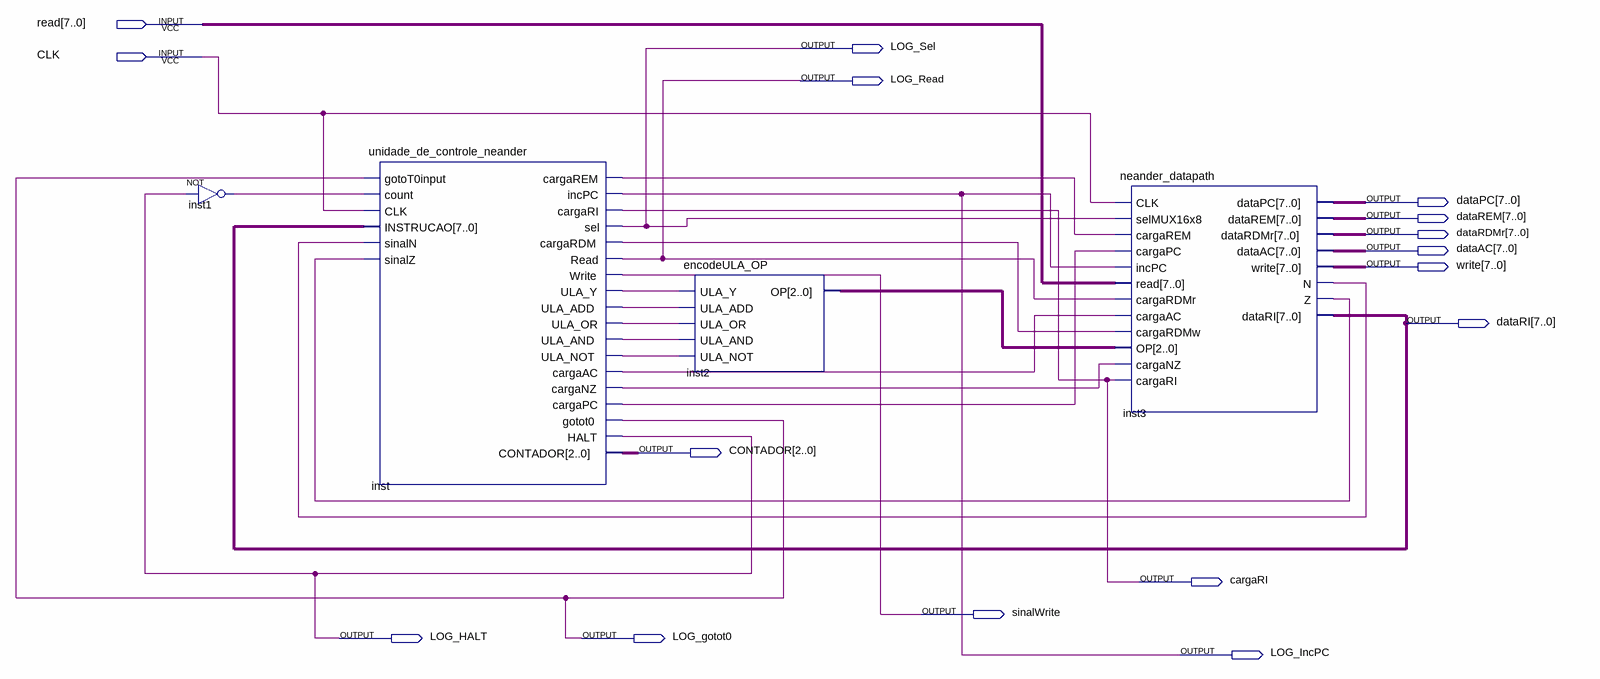
[diagram p0: schematic sheet]
// Quartus schematic neander.bdf as structural Verilog: 4 symbols, 16 pins
module neander (
  input  [7:0] read,
  input  CLK,
  output LOG_Sel,
  output LOG_Read,
  output [7:0] dataPC,
  output [7:0] dataREM,
  output [7:0] dataRDMr,
  output [7:0] dataAC,
  output [7:0] write,
  output [7:0] dataRI,
  output [2:0] CONTADOR,
  output cargaRI,
  output sinalWrite,
  output LOG_HALT,
  output LOG_gotot0,
  output LOG_IncPC
);

  wire inst1_out, inst3_n, inst3_z, inst_cargaac, inst_carganz, inst_cargapc, inst_cargardm, inst_cargarem,
       inst_ula_add, inst_ula_and, inst_ula_not, inst_ula_or, inst_ula_y;
  wire [2:0] inst2_op;

  not inst1 (inst1_out, LOG_HALT);
  unidade_de_controle_neander inst (
    .gotoT0input(LOG_gotot0), .count(inst1_out), .CLK(CLK), .INSTRUCAO(dataRI), .sinalN(inst3_n),
    .sinalZ(inst3_z), .cargaREM(inst_cargarem), .incPC(LOG_IncPC), .cargaRI(cargaRI), .sel(LOG_Sel),
    .cargaRDM(inst_cargardm), .Read(LOG_Read), .Write(sinalWrite), .ULA_Y(inst_ula_y),
    .ULA_ADD(inst_ula_add), .ULA_OR(inst_ula_or), .ULA_AND(inst_ula_and), .ULA_NOT(inst_ula_not),
    .cargaAC(inst_cargaac), .cargaNZ(inst_carganz), .cargaPC(inst_cargapc), .gotot0(LOG_gotot0),
    .HALT(LOG_HALT), .CONTADOR(CONTADOR));
  encodeULA_OP inst2 (
    .ULA_Y(inst_ula_y), .ULA_ADD(inst_ula_add), .ULA_OR(inst_ula_or), .ULA_AND(inst_ula_and),
    .ULA_NOT(inst_ula_not), .OP(inst2_op));
  neander_datapath inst3 (
    .CLK(CLK), .selMUX16x8(LOG_Sel), .cargaREM(inst_cargarem), .cargaPC(inst_cargapc), .incPC(LOG_IncPC),
    .read(read), .cargaRDMr(LOG_Read), .cargaAC(inst_cargaac), .cargaRDMw(inst_cargardm), .OP(inst2_op),
    .cargaNZ(inst_carganz), .cargaRI(cargaRI), .dataPC(dataPC), .dataREM(dataREM), .dataRDMr(dataRDMr),
    .dataAC(dataAC), .write(write), .N(inst3_n), .Z(inst3_z), .dataRI(dataRI));
endmodule
